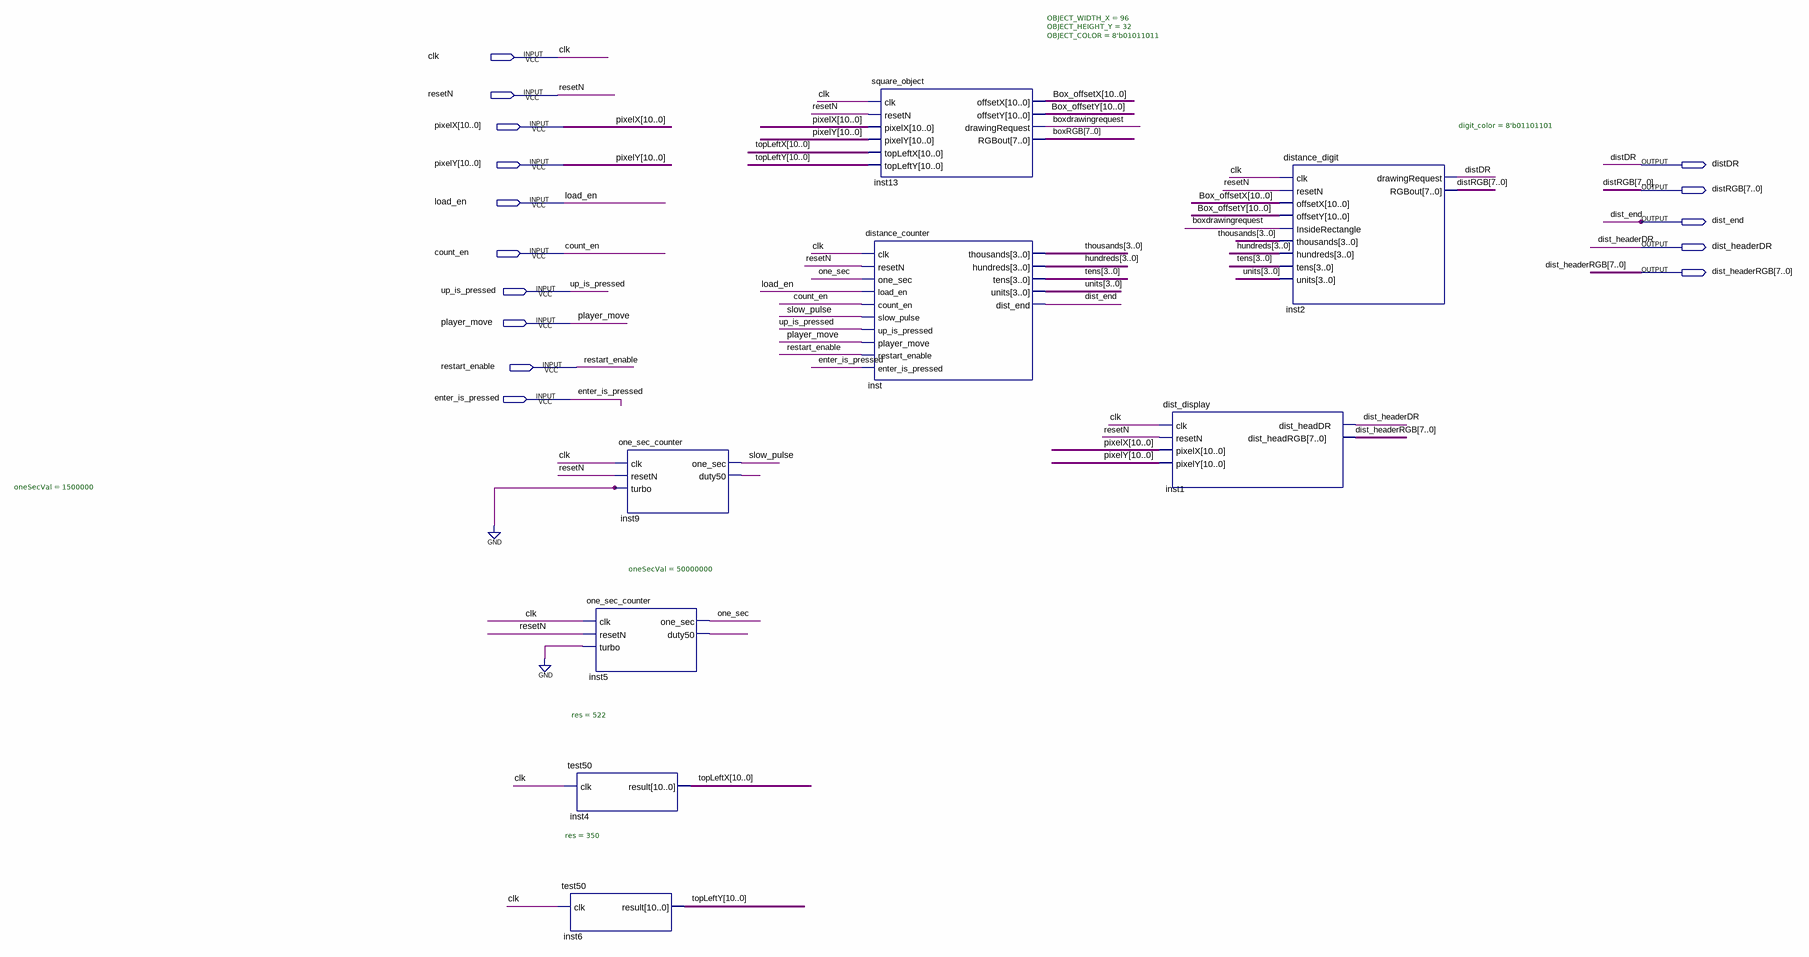
[diagram p0: schematic sheet]
// Quartus schematic distance_block.bdf as structural Verilog: 8 symbols, 15 pins
module distance_block (
  input  clk,
  input  resetN,
  input  [10:0] pixelX,
  input  [10:0] pixelY,
  input  load_en,
  input  count_en,
  input  up_is_pressed,
  input  player_move,
  input  restart_enable,
  input  enter_is_pressed,
  output distDR,
  output [7:0] distRGB,
  output dist_end,
  output dist_headerDR,
  output [7:0] dist_headerRGB
);

  wire boxdrawingrequest, inst5_duty50, inst9_duty50, one_sec, slow_pulse;
  wire [3:0] hundreds, tens, thousands, units;
  wire [7:0] boxRGB;
  wire [10:0] Box_offsetX, Box_offsetY, topLeftX, topLeftY;

  test50 #(.res(350)) inst6 (.clk(clk), .result(topLeftY));
  one_sec_counter #(.oneSecVal(50000000)) inst5 (
    .clk(clk), .resetN(resetN), .turbo(1'b0), .one_sec(one_sec), .duty50(inst5_duty50));
  test50 #(.res(522)) inst4 (.clk(clk), .result(topLeftX));
  one_sec_counter #(.oneSecVal(1500000)) inst9 (
    .clk(clk), .resetN(resetN), .turbo(1'b0), .one_sec(slow_pulse), .duty50(inst9_duty50));
  distance_counter inst (
    .clk(clk), .resetN(resetN), .one_sec(one_sec), .load_en(load_en), .count_en(count_en),
    .slow_pulse(slow_pulse), .up_is_pressed(up_is_pressed), .player_move(player_move),
    .restart_enable(restart_enable), .enter_is_pressed(enter_is_pressed), .thousands(thousands),
    .hundreds(hundreds), .tens(tens), .units(units), .dist_end(dist_end));
  square_object #(.OBJECT_WIDTH_X(96), .OBJECT_HEIGHT_Y(32), .OBJECT_COLOR(8'b01011011)) inst13 (
    .clk(clk), .resetN(resetN), .pixelX(pixelX), .pixelY(pixelY), .topLeftX(topLeftX), .topLeftY(topLeftY),
    .offsetX(Box_offsetX), .offsetY(Box_offsetY), .drawingRequest(boxdrawingrequest), .RGBout(boxRGB));
  dist_display inst1 (
    .clk(clk), .resetN(resetN), .pixelX(pixelX), .pixelY(pixelY), .dist_headDR(dist_headerDR),
    .dist_headRGB(dist_headerRGB));
  distance_digit #(.digit_color(8'b01101101)) inst2 (
    .clk(clk), .resetN(resetN), .offsetX(Box_offsetX), .offsetY(Box_offsetY),
    .InsideRectangle(boxdrawingrequest), .thousands(thousands), .hundreds(hundreds), .tens(tens),
    .units(units), .drawingRequest(distDR), .RGBout(distRGB));
endmodule
